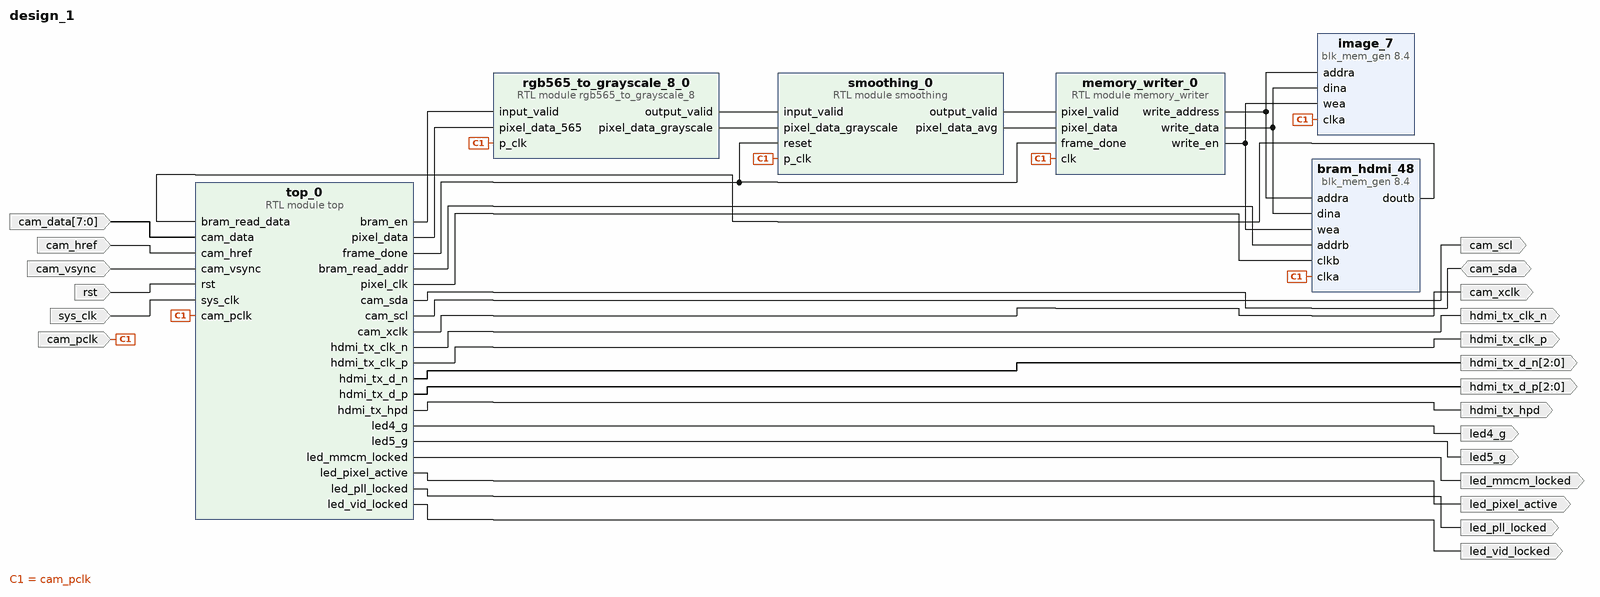
[diagram p0: block diagram of the top level]
# Vivado block design design_1, xc7z020clg400-1, Vivado 2025.2
create_bd_design design_1

create_bd_port -dir I -from 7 -to 0 cam_data
create_bd_port -dir I cam_href
create_bd_port -dir I cam_pclk
create_bd_port -dir O cam_scl
create_bd_port -dir IO cam_sda
create_bd_port -dir I cam_vsync
create_bd_port -dir O cam_xclk
create_bd_port -dir O -from 2 -to 0 hdmi_tx_d_n
create_bd_port -dir O -from 2 -to 0 hdmi_tx_d_p
create_bd_port -dir O hdmi_tx_hpd
create_bd_port -dir O led4_g
create_bd_port -dir O led5_g
create_bd_port -dir O led_mmcm_locked
create_bd_port -dir O led_pixel_active
create_bd_port -dir O led_pll_locked
create_bd_port -dir O led_vid_locked
create_bd_port -dir I -type clk sys_clk
create_bd_port -dir O -type clk hdmi_tx_clk_p
create_bd_port -dir O -type clk hdmi_tx_clk_n
create_bd_port -dir I -type rst rst

create_bd_cell -type module -reference top top_0
create_bd_cell -type module -reference rgb565_to_grayscale_8 rgb565_to_grayscale_8_0
create_bd_cell -type module -reference memory_writer memory_writer_0
create_bd_cell -type ip -vlnv xilinx.com:ip:blk_mem_gen:8.4 bram_hdmi_48
set_property -dict [list \
  CONFIG.Enable_A Always_Enabled \
  CONFIG.Enable_B Always_Enabled \
  CONFIG.Fill_Remaining_Memory_Locations false \
  CONFIG.Load_Init_File false \
  CONFIG.Memory_Type Simple_Dual_Port_RAM \
  CONFIG.Operating_Mode_A WRITE_FIRST \
  CONFIG.Write_Depth_A 2304 \
  CONFIG.Write_Width_A 8 \
  CONFIG.use_bram_block Stand_Alone \
] [get_bd_cells bram_hdmi_48]
create_bd_cell -type module -reference smoothing smoothing_0
create_bd_cell -type ip -vlnv xilinx.com:ip:blk_mem_gen:8.4 image_7
set_property -dict [list \
  CONFIG.Enable_A Always_Enabled \
  CONFIG.Memory_Type Simple_Dual_Port_RAM \
  CONFIG.Write_Depth_A 2304 \
  CONFIG.Write_Width_A 8 \
  CONFIG.use_bram_block Stand_Alone \
] [get_bd_cells image_7]

# ---- connections ----

connect_bd_net [get_bd_ports cam_sda] [get_bd_pins top_0/cam_sda]
connect_bd_net -net cam_data_0_1 [get_bd_ports cam_data] [get_bd_pins top_0/cam_data]
connect_bd_net -net cam_href_0_1 [get_bd_ports cam_href] [get_bd_pins top_0/cam_href]
connect_bd_net -net cam_pclk_0_1 [get_bd_ports cam_pclk] \
  [get_bd_pins memory_writer_0/clk] [get_bd_pins bram_hdmi_48/clka] [get_bd_pins smoothing_0/p_clk] \
  [get_bd_pins image_7/clka] [get_bd_pins rgb565_to_grayscale_8_0/p_clk] [get_bd_pins top_0/cam_pclk]
connect_bd_net -net cam_vsync_0_1 [get_bd_ports cam_vsync] [get_bd_pins top_0/cam_vsync]
connect_bd_net -net image_7_doutb [get_bd_pins bram_hdmi_48/doutb] [get_bd_pins top_0/bram_read_data]
connect_bd_net [get_bd_pins memory_writer_0/write_address] [get_bd_pins bram_hdmi_48/addra] [get_bd_pins image_7/addra]
connect_bd_net [get_bd_pins memory_writer_0/write_data] [get_bd_pins bram_hdmi_48/dina] [get_bd_pins image_7/dina]
connect_bd_net [get_bd_pins memory_writer_0/write_en] [get_bd_pins bram_hdmi_48/wea] [get_bd_pins image_7/wea]
connect_bd_net [get_bd_pins rgb565_to_grayscale_8_0/output_valid] [get_bd_pins smoothing_0/input_valid]
connect_bd_net [get_bd_pins rgb565_to_grayscale_8_0/pixel_data_grayscale] [get_bd_pins smoothing_0/pixel_data_grayscale]
connect_bd_net -net rst_0_1 [get_bd_ports rst] [get_bd_pins top_0/rst]
connect_bd_net [get_bd_pins smoothing_0/output_valid] [get_bd_pins memory_writer_0/pixel_valid]
connect_bd_net [get_bd_pins smoothing_0/pixel_data_avg] [get_bd_pins memory_writer_0/pixel_data]
connect_bd_net -net sys_clk_0_1 [get_bd_ports sys_clk] [get_bd_pins top_0/sys_clk]
connect_bd_net [get_bd_pins top_0/bram_en] [get_bd_pins rgb565_to_grayscale_8_0/input_valid]
connect_bd_net [get_bd_pins top_0/bram_read_addr] [get_bd_pins bram_hdmi_48/addrb]
connect_bd_net [get_bd_pins top_0/cam_scl] [get_bd_ports cam_scl]
connect_bd_net [get_bd_pins top_0/cam_xclk] [get_bd_ports cam_xclk]
connect_bd_net [get_bd_pins top_0/frame_done] [get_bd_pins memory_writer_0/frame_done] [get_bd_pins smoothing_0/reset]
connect_bd_net [get_bd_pins top_0/hdmi_tx_clk_n] [get_bd_ports hdmi_tx_clk_n]
connect_bd_net [get_bd_pins top_0/hdmi_tx_clk_p] [get_bd_ports hdmi_tx_clk_p]
connect_bd_net [get_bd_pins top_0/hdmi_tx_d_n] [get_bd_ports hdmi_tx_d_n]
connect_bd_net [get_bd_pins top_0/hdmi_tx_d_p] [get_bd_ports hdmi_tx_d_p]
connect_bd_net [get_bd_pins top_0/hdmi_tx_hpd] [get_bd_ports hdmi_tx_hpd]
connect_bd_net [get_bd_pins top_0/led4_g] [get_bd_ports led4_g]
connect_bd_net [get_bd_pins top_0/led5_g] [get_bd_ports led5_g]
connect_bd_net [get_bd_pins top_0/led_mmcm_locked] [get_bd_ports led_mmcm_locked]
connect_bd_net [get_bd_pins top_0/led_pixel_active] [get_bd_ports led_pixel_active]
connect_bd_net [get_bd_pins top_0/led_pll_locked] [get_bd_ports led_pll_locked]
connect_bd_net [get_bd_pins top_0/led_vid_locked] [get_bd_ports led_vid_locked]
connect_bd_net [get_bd_pins top_0/pixel_clk] [get_bd_pins bram_hdmi_48/clkb]
connect_bd_net [get_bd_pins top_0/pixel_data] [get_bd_pins rgb565_to_grayscale_8_0/pixel_data_565]

validate_bd_design
save_bd_design
